# Altium schematic sheet Sheet1.SchDoc: Nucleo-64 Connectors
size B; Revision: A
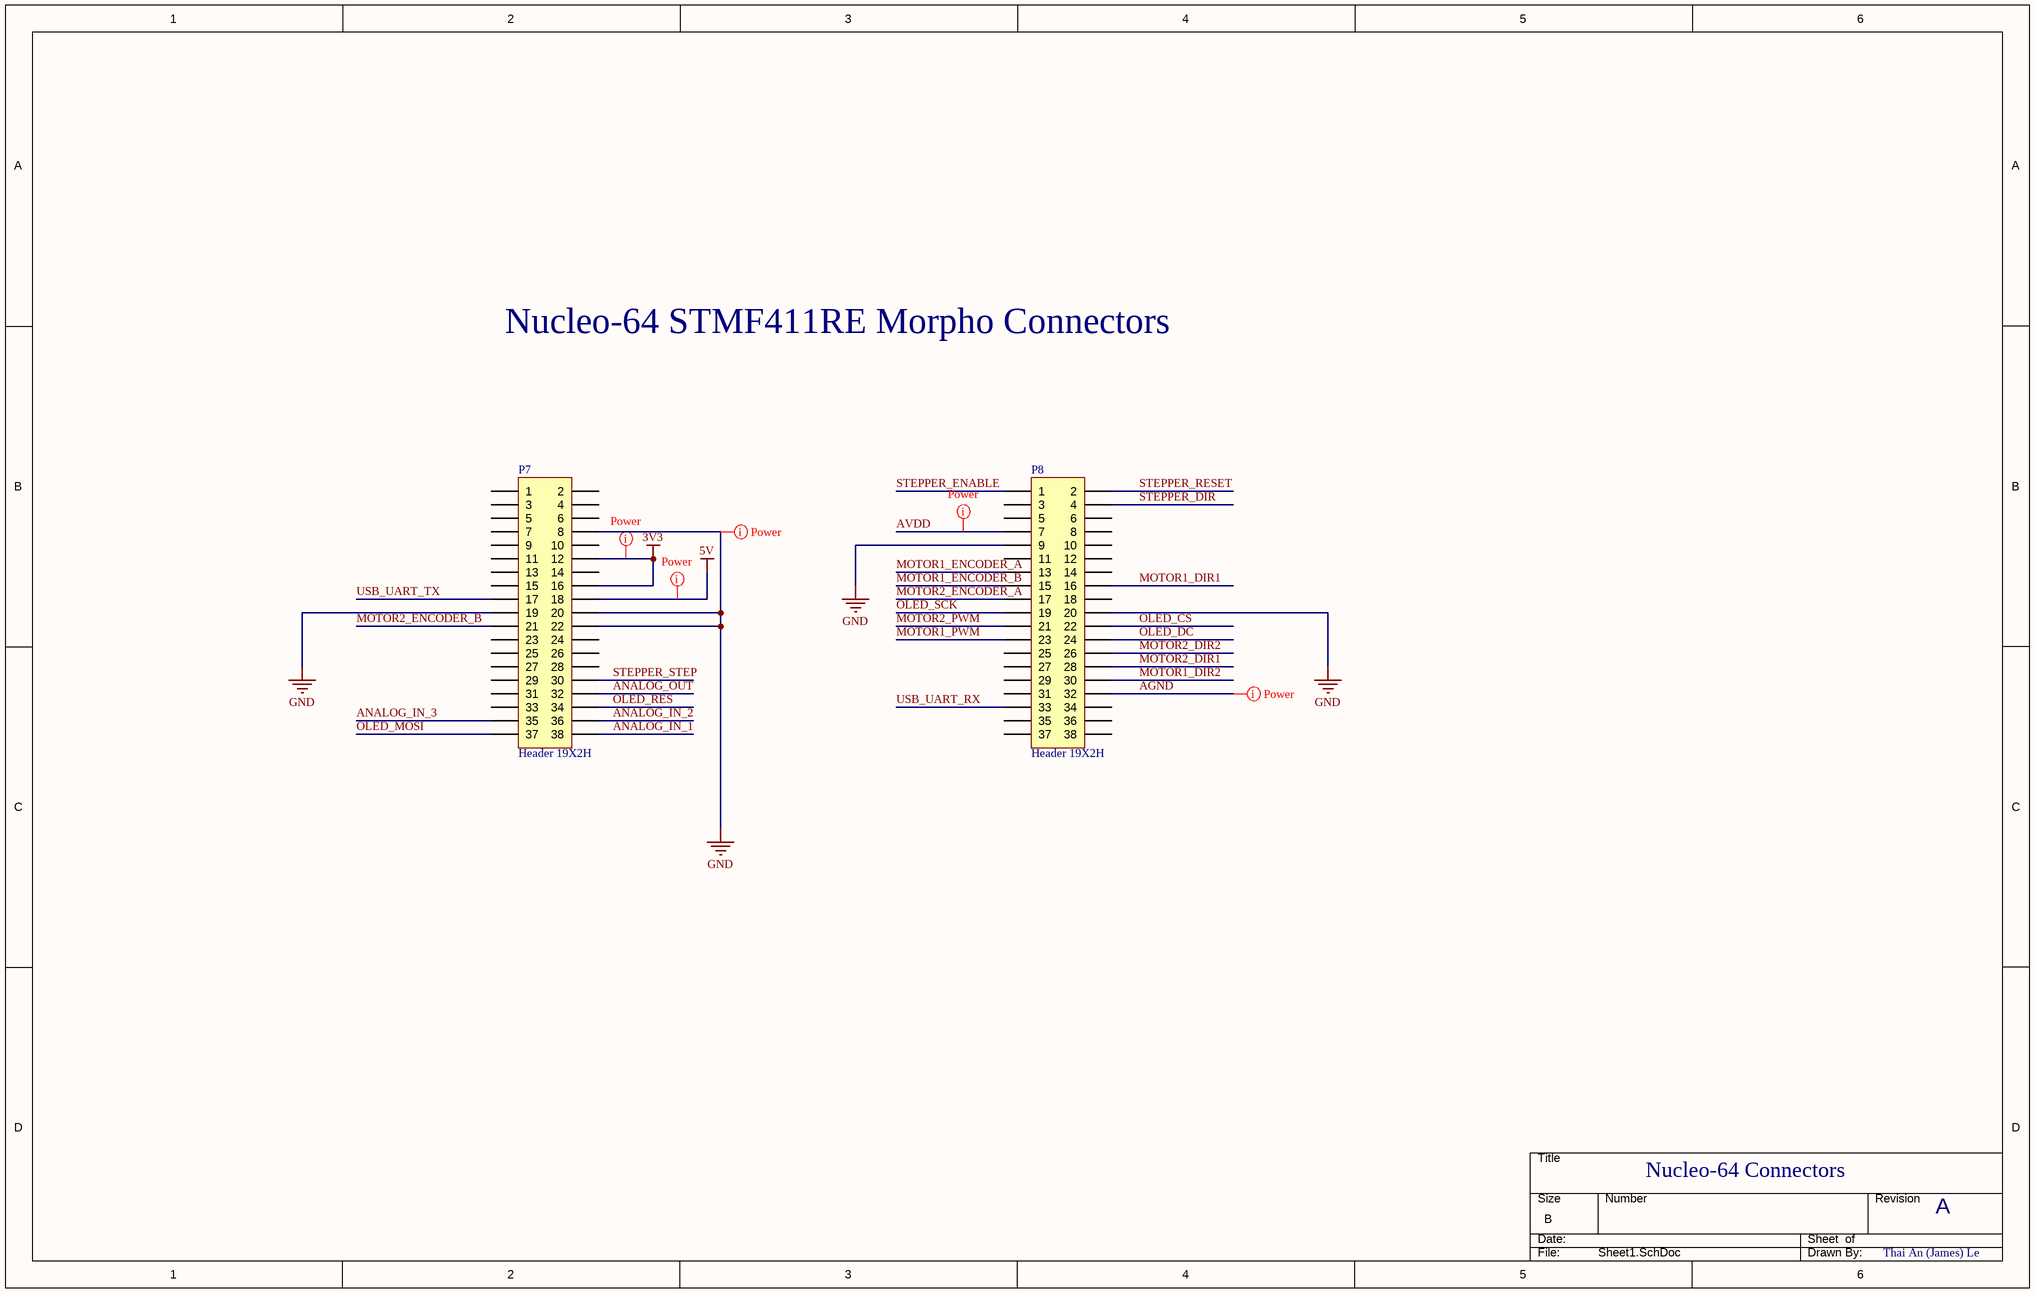
[diagram p0: Sheet1.SchDoc]

## Parts
P7  Header 19X2H  [PPPC192LFBN-RC]
P8  Header 19X2H  [PPPC192LFBN-RC]

## Nets
3V3: P7.12 P7.16
5V: P7.18
GND: P7.8 P7.19 P7.20 P7.22 P8.9 P8.20
AGND: P8.32
ANALOG_IN_1: P7.38
ANALOG_IN_2: P7.36
ANALOG_IN_3: P7.35
ANALOG_OUT: P7.32
AVDD: P8.7
MOTOR1_DIR1: P8.16
MOTOR1_DIR2: P8.30
MOTOR1_ENCODER_A: P8.13
MOTOR1_ENCODER_B: P8.15
MOTOR1_PWM: P8.23
MOTOR2_DIR1: P8.28
MOTOR2_DIR2: P8.26
MOTOR2_ENCODER_A: P8.17
MOTOR2_ENCODER_B: P7.21
MOTOR2_PWM: P8.21
OLED_CS: P8.22
OLED_DC: P8.24
OLED_MOSI: P7.37
OLED_RES: P7.34
OLED_SCK: P8.19
STEPPER_DIR: P8.4
STEPPER_ENABLE: P8.1
STEPPER_RESET: P8.2
STEPPER_STEP: P7.30
USB_UART_RX: P8.33
USB_UART_TX: P7.17

Not connected (* = marked no-connect by the designer): P7 1 2 3 4 5 6 7 9 10 11 13 14 15 23 24 25 26 27 28 29 31 33; P8 3 5 6 8 10 11 12 14 18 25 27 29 31 34 35 36 37 38

## Layout directives
net class POWER: 3V3, 5V, AGND, AVDD, GND

## Notes on the sheet
- Nucleo-64 STMF411RE Morpho Connectors
- Nucleo-64 Connectors
- A
- Thai An (James) Le
- DWG. NO.
- REV.
- SHT.
- THIS DOCUMENT AND THE DATA DISCLOSED HEREIN OR HEREWITH IS THE PROPERTY OF ALTIUM LIMITED AND MAY BE FREELY DISTRIBUTED IN WHOLE. NO RIGHTS ARE RESERVED OR EXPRESS OR IMPLIED WARANTEE GIVEN.
- REVISION
- DESCRIPTION
- DATE
- APPROVED
- ENG:
- APPROVALS
- PROJECT
- DSN:
- CHK:
- REFERENCE DOCUMENTS
- PROJECT REVISION:
- TITLE
- DOCUMENT REVISION:
- DESIGN ITEM:
- BOM:
- FAB DWG:
- PCB DWG:
- ASSY DWG:
- SCALE:
- SIZE
- B
- CAGE CODE
- FILE NAME
- DWG NO.
- SHEET
- OF
- REV

## Library data of the parts
P7 P8 = Header 19X2H: 38 Position Header Connector 0.100in (2.54mm) Through Hole Gold; PN: S7122-ND; URL: https://www.digikey.ca/product-detail/en/sullins-connector-solutions/PPPC192LFBN-RC/S7122-ND; MPN: PPPC192LFBN-RC